# Altium schematic sheet GPIO-USB.SchDoc: =ProjectTitle
size 297 x 209 mm; Address1: Address1; Address2: Address2; Address3: Address3; Address4: Address4; SheetNumber: 6; SheetTotal: 16; Scale: 1:1; DocumentType: Схема электрическая принципиальная
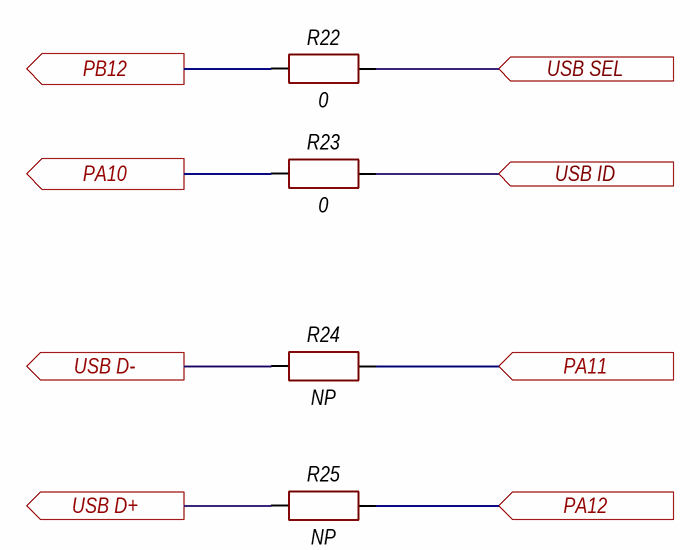
[diagram p0: GPIO-USB.SchDoc]

## Parts
R22  0  [CH0402R]
R23  0  [CH0402R]
R24  NP  [CH0402R]
R25  NP  [CH0402R]

## Ports
PA10 (out), PA11 (in), PA12 (in), PB12 (out), USB D+ (out), USB D- (out), USB ID (in), USB SEL (in)

## Nets
PA10: R23.1 ; port PA10
PA11: R24.2 ; port PA11
PA12: R25.2 ; port PA12
PB12: R22.1 ; port PB12
USB D+: R25.1 ; port USB D+
USB D-: R24.1 ; port USB D-
USB ID: R23.2 ; port USB ID
USB SEL: R22.2 ; port USB SEL

## Notes on the sheet
- Изм.
- Лист
- № докум.
- Подп.
- Дата
- Копировал
- Формат А4

## Library data of the parts
R22 R23 = Resistor: Manufacturer: *; Model: *; HelpURL: *; ComponentKind: *; Value: 0
R24 R25 = Resistor: Value: 0; Manufacturer: *; Model: *; HelpURL: *; ComponentKind: *; NP: NP